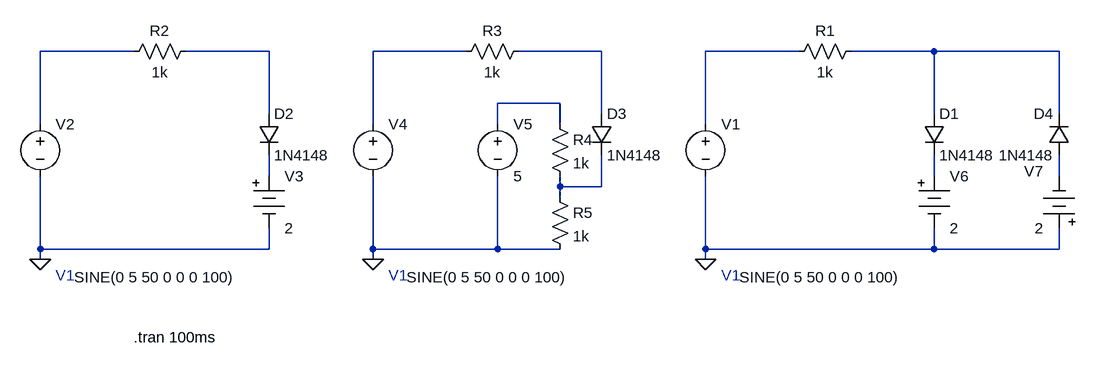
[diagram p0: schematic diode_clipper.asc]
diode_clipper.asc, the LTspice schematic file:
Version 4
SHEET 1 1588 680
WIRE 128 128 -16 128
WIRE 336 128 208 128
WIRE 640 128 496 128
WIRE 848 128 720 128
WIRE 1152 128 1008 128
WIRE 1360 128 1232 128
WIRE 1552 128 1360 128
WIRE 784 208 688 208
WIRE 336 224 336 128
WIRE 848 224 848 128
WIRE 1360 224 1360 128
WIRE 1552 224 1552 128
WIRE -16 240 -16 128
WIRE 496 240 496 128
WIRE 688 240 688 208
WIRE 784 240 784 208
WIRE 1008 240 1008 128
WIRE 336 320 336 288
WIRE 1360 320 1360 288
WIRE 1552 320 1552 288
WIRE 784 336 784 320
WIRE 848 336 848 288
WIRE 848 336 784 336
WIRE 784 352 784 336
WIRE -16 432 -16 320
WIRE 336 432 336 400
WIRE 336 432 -16 432
WIRE 496 432 496 320
WIRE 688 432 688 320
WIRE 688 432 496 432
WIRE 784 432 688 432
WIRE 1008 432 1008 320
WIRE 1360 432 1360 400
WIRE 1360 432 1008 432
WIRE 1552 432 1552 400
WIRE 1552 432 1360 432
WIRE -16 448 -16 432
WIRE 496 448 496 432
WIRE 1008 448 1008 432
FLAG -16 448 0
FLAG 496 448 0
FLAG 1008 448 0
SYMBOL diode 320 224 R0
SYMATTR InstName D2
SYMATTR Value 1N4148
SYMBOL Voltage -16 224 R0
WINDOW 3 52 251 Left 2
SYMATTR InstName V2
SYMATTR Value SINE(0 5 50 0 0 0 100)
SYMBOL Res 224 112 R90
WINDOW 0 0 56 VBottom 2
WINDOW 3 32 56 VTop 2
SYMATTR InstName R2
SYMATTR Value 1k
SYMBOL Misc/battery 336 304 R0
SYMATTR InstName V3
SYMATTR Value 2
SYMBOL diode 832 224 R0
SYMATTR InstName D3
SYMATTR Value 1N4148
SYMBOL Voltage 496 224 R0
WINDOW 3 52 251 Left 2
SYMATTR InstName V4
SYMATTR Value SINE(0 5 50 0 0 0 100)
SYMBOL Res 736 112 R90
WINDOW 0 0 56 VBottom 2
WINDOW 3 32 56 VTop 2
SYMATTR InstName R3
SYMATTR Value 1k
SYMBOL Voltage 688 224 R0
SYMATTR InstName V5
SYMATTR Value 5
SYMATTR SpiceLine Rser=0
SYMBOL Res 768 224 R0
SYMATTR InstName R4
SYMATTR Value 1k
SYMBOL Res 768 336 R0
SYMATTR InstName R5
SYMATTR Value 1k
SYMBOL diode 1344 224 R0
SYMATTR InstName D1
SYMATTR Value 1N4148
SYMBOL Voltage 1008 224 R0
WINDOW 3 52 251 Left 2
SYMATTR InstName V1
SYMATTR Value SINE(0 5 50 0 0 0 100)
SYMBOL Res 1248 112 R90
WINDOW 0 0 56 VBottom 2
WINDOW 3 32 56 VTop 2
SYMATTR InstName R1
SYMATTR Value 1k
SYMBOL Misc/battery 1360 304 R0
SYMATTR InstName V6
SYMATTR Value 2
SYMBOL diode 1568 288 R180
WINDOW 0 24 64 Left 2
WINDOW 3 24 0 Left 2
SYMATTR InstName D4
SYMATTR Value 1N4148
SYMBOL Misc/battery 1552 416 R180
WINDOW 0 24 104 Left 2
WINDOW 3 24 16 Left 2
SYMATTR InstName V7
SYMATTR Value 2
TEXT 128 568 Left 2 !.tran 100ms
TEXT 8 472 Left 2 ;V1
TEXT 520 472 Left 2 ;V1
TEXT 1032 472 Left 2 ;V1

The netlist it stands for:
* diode_clipper.asc
D2 N002 N008 1N4148
V2 N001 0 SINE(0 5 50 0 0 0 100)
R2 N002 N001 1k
V3 N008 0 2
D3 N004 N011 1N4148
V4 N003 0 SINE(0 5 50 0 0 0 100)
R3 N004 N003 1k
V5 N007 0 5 Rser=0
R4 N007 N011 1k
R5 N011 0 1k
D1 N006 N009 1N4148
V1 N005 0 SINE(0 5 50 0 0 0 100)
R1 N006 N005 1k
V6 N009 0 2
D4 N010 N006 1N4148
V7 0 N010 2
.model D D
.lib standard.dio
.tran 100ms
* V1
* V1
* V1
.backanno
.end